# Altium project GECKO3.PRJPCB (part 4 of 4)

## Sheet dram2.SCHDOC: Second DDR SDRAM
size A3; Organization: Berne University of Applied Science; Address1: School of Engineering and; Address2: Information Technology; Address3: Quellgasse 21; Address4: CH-2501 Biel; Revision: 1.0; SheetNumber: 10; SheetTotal: 19; ApprovedBy: zem1; Author: zac1
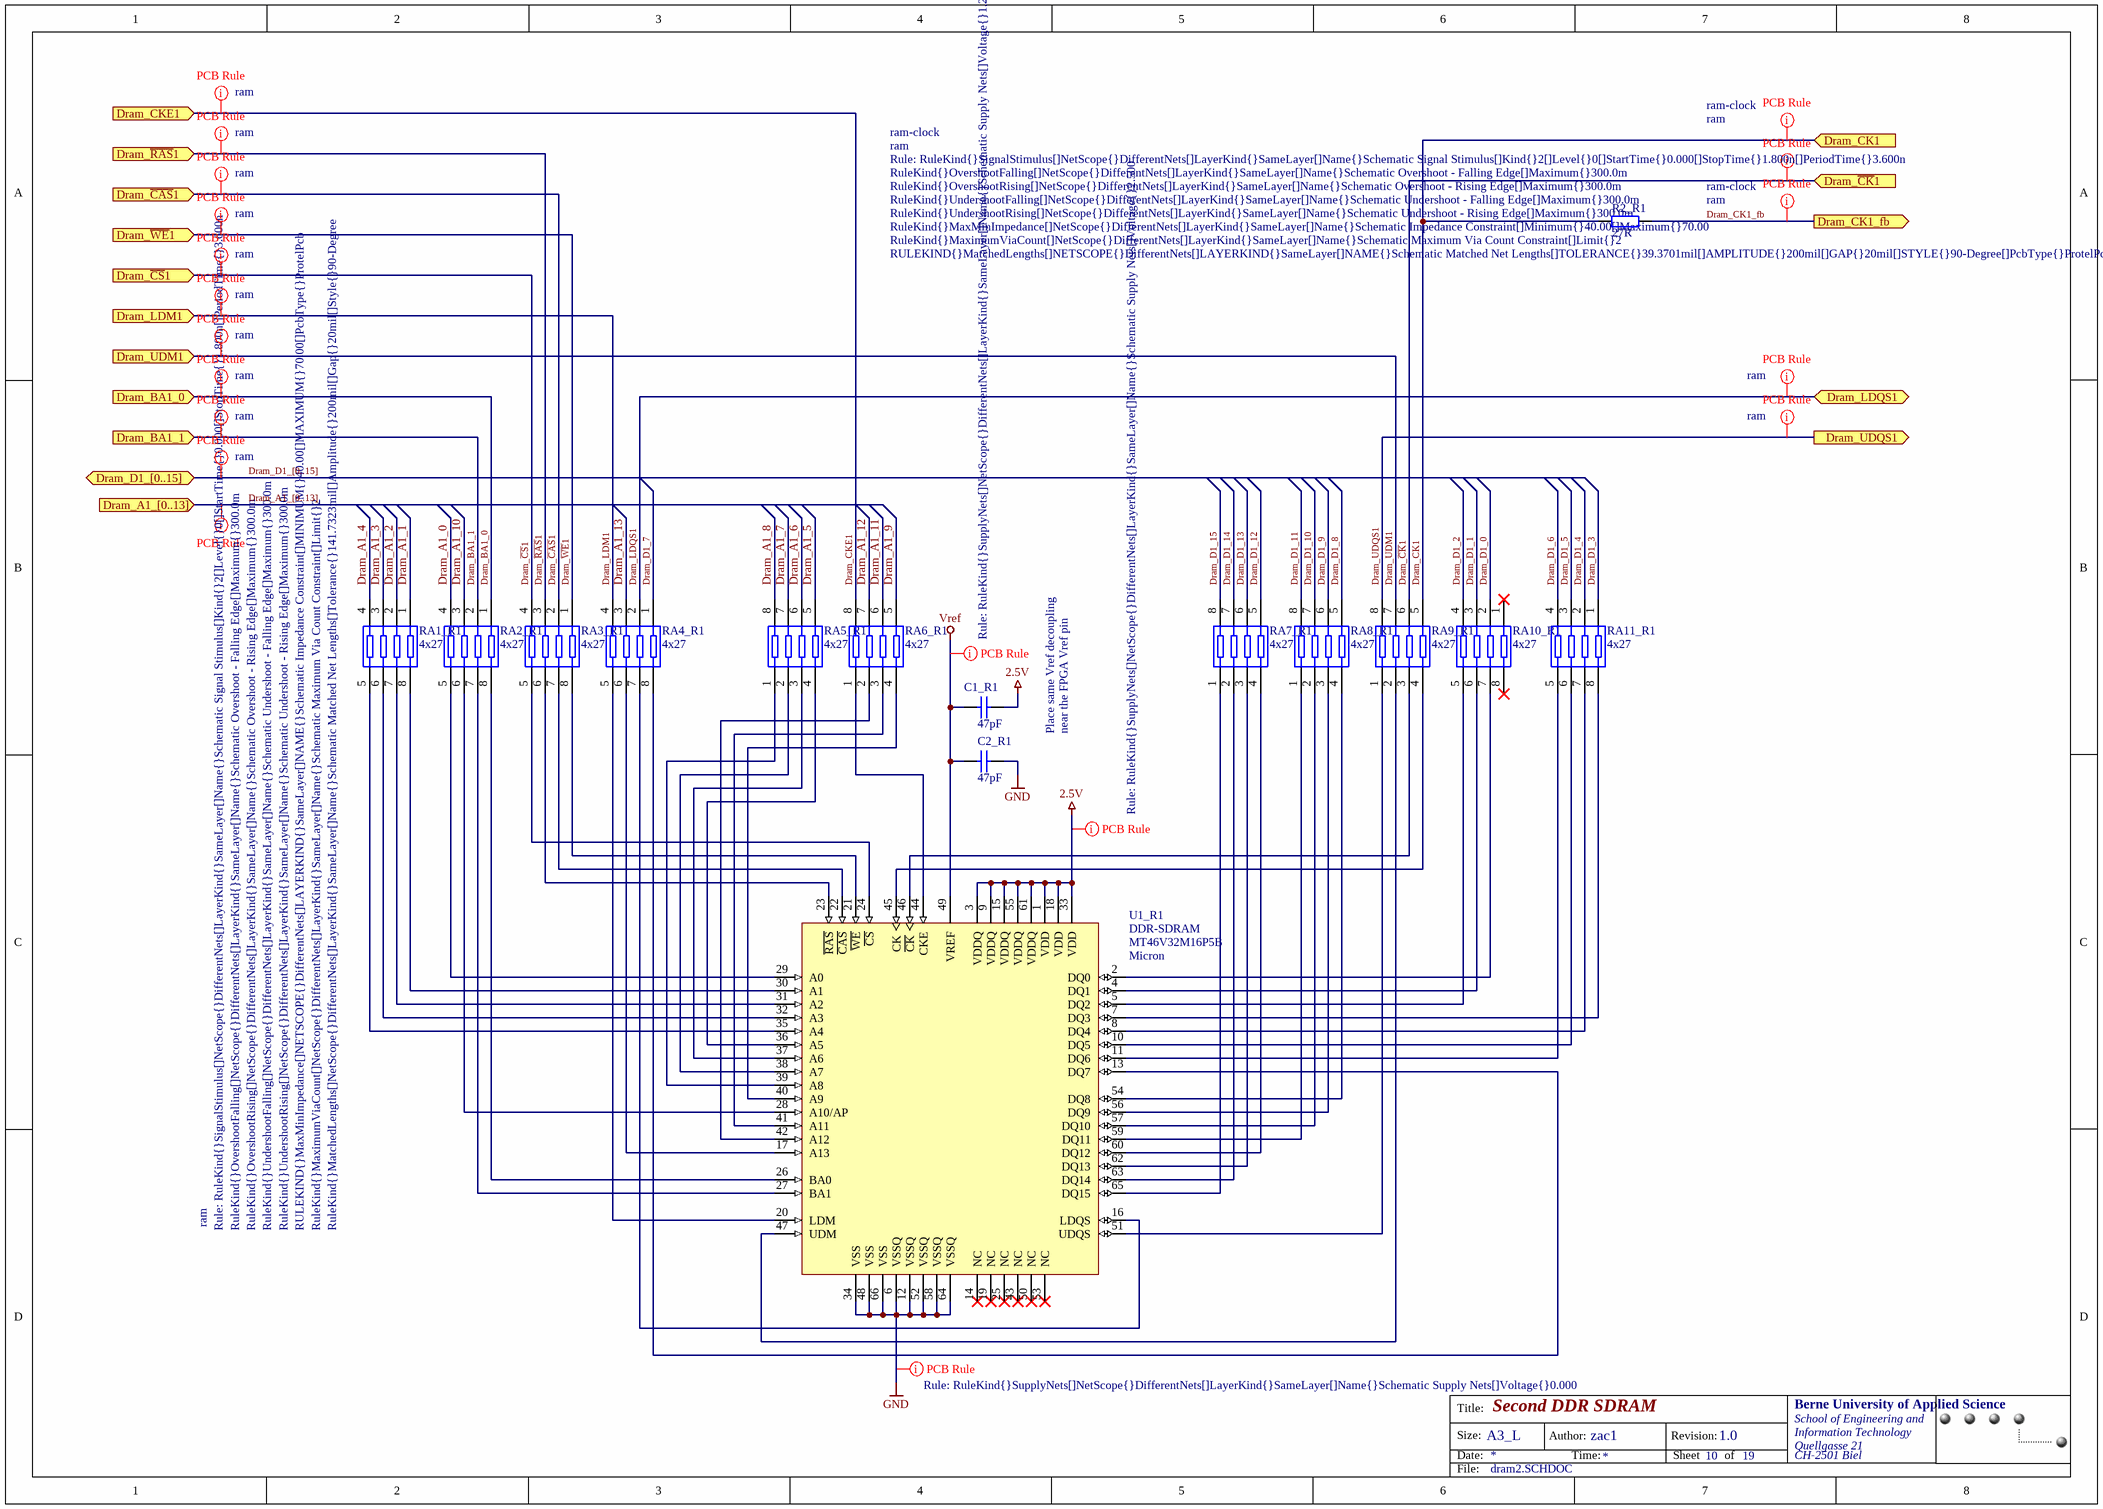
[diagram p16: dram2.SCHDOC]

### Parts
C1_R1  value 47pF  [0402]  (hidden comment: Cap)
C2_R1  value 47pF  [0402]  (hidden comment: Cap)
R2_R1  value 27R  [0402]  (hidden comment: Res2)
RA1_R1  value 4x27  [1206_ARRAY]
RA2_R1  value 4x27  [1206_ARRAY]
RA3_R1  value 4x27  [1206_ARRAY]
RA4_R1  value 4x27  [1206_ARRAY]
RA5_R1  value 4x27  [1206_ARRAY]
RA6_R1  value 4x27  [1206_ARRAY]
RA7_R1  value 4x27  [1206_ARRAY]
RA8_R1  value 4x27  [1206_ARRAY]
RA9_R1  value 4x27  [1206_ARRAY]
RA10_R1  value 4x27  [1206_ARRAY]
RA11_R1  value 4x27  [1206_ARRAY]
U1_R1  DDR-SDRAM  value MT46V32M16P5B  vendor: Micron  [TSOP66]

### Ports
Dram_A1_[0..13] (in), Dram_BA1_0 (in), Dram_BA1_1 (in), Dram_CK1 (in), Dram_CK1_fb (out), Dram_CKE1 (in), Dram_D1_[0..15] (bidir), Dram_LDM1 (in), Dram_LDQS1 (bidir), Dram_UDM1 (in), Dram_UDQS1 (out), Dram_~{CAS}1 (in), Dram_~{CK}1 (in), Dram_~{CS}1 (in), Dram_~{RAS}1 (in), Dram_~{WE}1 (in)

### Nets
2.5V: C1_R1.1 U1_R1.1(VDD) U1_R1.3(VDDQ) U1_R1.9(VDDQ) U1_R1.15(VDDQ) U1_R1.18(VDD) U1_R1.33(VDD) U1_R1.55(VDDQ) U1_R1.61(VDDQ)
GND: C2_R1.1 U1_R1.6(VSSQ) U1_R1.12(VSSQ) U1_R1.34(VSS) U1_R1.48(VSS) U1_R1.52(VSSQ) U1_R1.58(VSSQ) U1_R1.64(VSSQ) U1_R1.66(VSS)
Vref: C1_R1.2 C2_R1.2 U1_R1.49(VREF)
Dram_A1_0: RA2_R1.4
Dram_A1_1: RA1_R1.1
Dram_A1_2: RA1_R1.2
Dram_A1_3: RA1_R1.3
Dram_A1_4: RA1_R1.4
Dram_A1_5: RA5_R1.5
Dram_A1_6: RA5_R1.6
Dram_A1_7: RA5_R1.7
Dram_A1_8: RA5_R1.8
Dram_A1_9: RA6_R1.5
Dram_A1_10: RA2_R1.3
Dram_A1_11: RA6_R1.6
Dram_A1_12: RA6_R1.7
Dram_A1_13: RA4_R1.3
Dram_BA1_0: RA2_R1.1 ; port Dram_BA1_0
Dram_BA1_1: RA2_R1.2 ; port Dram_BA1_1
Dram_~{CAS}1: RA3_R1.2 ; port Dram_~{CAS}1
Dram_~{CK}1: RA9_R1.6 ; port Dram_~{CK}1
Dram_~{CS}1: RA3_R1.4 ; port Dram_~{CS}1
Dram_CK1: R2_R1.2 RA9_R1.5 ; port Dram_CK1
DRAM_CK1_FB: R2_R1.1 ; port Dram_CK1_fb
Dram_CKE1: RA6_R1.8 ; port Dram_CKE1
Dram_D1_0: RA10_R1.2
Dram_D1_1: RA10_R1.3
Dram_D1_2: RA10_R1.4
Dram_D1_3: RA11_R1.1
Dram_D1_4: RA11_R1.2
Dram_D1_5: RA11_R1.3
Dram_D1_6: RA11_R1.4
Dram_D1_7: RA4_R1.1
Dram_D1_8: RA8_R1.5
Dram_D1_9: RA8_R1.6
Dram_D1_10: RA8_R1.7
Dram_D1_11: RA8_R1.8
Dram_D1_12: RA7_R1.5
Dram_D1_13: RA7_R1.6
Dram_D1_14: RA7_R1.7
Dram_D1_15: RA7_R1.8
Dram_LDM1: RA4_R1.4 ; port Dram_LDM1
Dram_LDQS1: RA4_R1.2 ; port Dram_LDQS1
Dram_~{RAS}1: RA3_R1.3 ; port Dram_~{RAS}1
Dram_UDM1: RA9_R1.7 ; port Dram_UDM1
Dram_UDQS1: RA9_R1.8 ; port Dram_UDQS1
Dram_~{WE}1: RA3_R1.1 ; port Dram_~{WE}1
NetRA1_R1_5: RA1_R1.5 U1_R1.35(A4)
NetRA1_R1_6: RA1_R1.6 U1_R1.32(A3)
NetRA1_R1_7: RA1_R1.7 U1_R1.31(A2)
NetRA1_R1_8: RA1_R1.8 U1_R1.30(A1)
NetRA2_R1_5: RA2_R1.5 U1_R1.29(A0)
NetRA2_R1_6: RA2_R1.6 U1_R1.28(A10/AP)
NetRA2_R1_7: RA2_R1.7 U1_R1.27(BA1)
NetRA2_R1_8: RA2_R1.8 U1_R1.26(BA0)
NetRA3_R1_5: RA3_R1.5 U1_R1.24(~{CS})
NetRA3_R1_6: RA3_R1.6 U1_R1.23(~{RAS})
NetRA3_R1_7: RA3_R1.7 U1_R1.22(~{CAS})
NetRA3_R1_8: RA3_R1.8 U1_R1.21(~{WE})
NetRA4_R1_5: RA4_R1.5 U1_R1.20(LDM)
NetRA4_R1_6: RA4_R1.6 U1_R1.17(A13)
NetRA4_R1_7: RA4_R1.7 U1_R1.16(LDQS)
NetRA4_R1_8: RA4_R1.8 U1_R1.13(DQ7)
NetRA5_R1_1: RA5_R1.1 U1_R1.39(A8)
NetRA5_R1_2: RA5_R1.2 U1_R1.38(A7)
NetRA5_R1_3: RA5_R1.3 U1_R1.37(A6)
NetRA5_R1_4: RA5_R1.4 U1_R1.36(A5)
NetRA6_R1_1: RA6_R1.1 U1_R1.44(CKE)
NetRA6_R1_2: RA6_R1.2 U1_R1.42(A12)
NetRA6_R1_3: RA6_R1.3 U1_R1.41(A11)
NetRA6_R1_4: RA6_R1.4 U1_R1.40(A9)
NetRA7_R1_1: RA7_R1.1 U1_R1.65(DQ15)
NetRA7_R1_2: RA7_R1.2 U1_R1.63(DQ14)
NetRA7_R1_3: RA7_R1.3 U1_R1.62(DQ13)
NetRA7_R1_4: RA7_R1.4 U1_R1.60(DQ12)
NetRA8_R1_1: RA8_R1.1 U1_R1.59(DQ11)
NetRA8_R1_2: RA8_R1.2 U1_R1.57(DQ10)
NetRA8_R1_3: RA8_R1.3 U1_R1.56(DQ9)
NetRA8_R1_4: RA8_R1.4 U1_R1.54(DQ8)
NetRA9_R1_1: RA9_R1.1 U1_R1.51(UDQS)
NetRA9_R1_2: RA9_R1.2 U1_R1.47(UDM)
NetRA9_R1_3: RA9_R1.3 U1_R1.46(~{CK})
NetRA9_R1_4: RA9_R1.4 U1_R1.45(CK)
NetRA10_R1_5: RA10_R1.5 U1_R1.5(DQ2)
NetRA10_R1_6: RA10_R1.6 U1_R1.4(DQ1)
NetRA10_R1_7: RA10_R1.7 U1_R1.2(DQ0)
NetRA11_R1_5: RA11_R1.5 U1_R1.11(DQ6)
NetRA11_R1_6: RA11_R1.6 U1_R1.10(DQ5)
NetRA11_R1_7: RA11_R1.7 U1_R1.8(DQ4)
NetRA11_R1_8: RA11_R1.8 U1_R1.7(DQ3)

Not connected (* = marked no-connect by the designer): RA10_R1 1* 8*; U1_R1 14(NC)* 19(NC)* 25(NC)* 43(NC)* 50(NC)* 53(NC)*

### Buses and harness runs
bus Dram_A1_[0..13] = port Dram_A1_[0..13]
bus Dram_D1_[0..15] = port Dram_D1_[0..15]

### Layout directives
rule Supply Nets [Voltage =  2.500]: 2.5V
rule Supply Nets [Voltage =  1.250]: Vref
rule Supply Nets [Voltage =  0.000]: GND
rule Signal Stimulus [Kind - Periodic Pulse    Level - Low    Start Time =  0.000    Stop Time =  1.800n    Period Time =  3.600n]; rule Overshoot - Falling Edge [Max =  300.0m]; rule Overshoot - Rising Edge [Max =  300.0m]; rule Undershoot - Falling Edge [Max =  300.0m]; rule Undershoot - Rising Edge [Max =  300.0m]; rule Impedance Constraint [Min = 40.00    Max = 70.00    ]; rule Maximum Via Count Constraint [Max Count = 2]; rule Matched Net Lengths [Tolerance = 3.6mm    Style - 90 Degrees    Amplitude = 5.08mm    Gap = 0.508mm    ]; net class ram: (no net found under the mark)
net class ram: (no net found under the mark), Dram_BA1_0, Dram_BA1_1, Dram_CKE1, Dram_LDM1, Dram_LDQS1, Dram_UDM1, Dram_UDQS1, Dram_~{CAS}1, Dram_~{CS}1, Dram_~{RAS}1, Dram_~{WE}1
net class ram-clock; net class ram: Dram_CK1, DRAM_CK1_FB
rule Signal Stimulus [Kind - Periodic Pulse    Level - Low    Start Time =  0.000    Stop Time =  1.800n    Period Time =  3.600n]; rule Overshoot - Falling Edge [Max =  300.0m]; rule Overshoot - Rising Edge [Max =  300.0m]; rule Undershoot - Falling Edge [Max =  300.0m]; rule Undershoot - Rising Edge [Max =  300.0m]; rule Impedance Constraint [Min =  40.00    Max =  70.00    ]; rule Maximum Via Count Constraint [Max Count = 2]; rule Matched Net Lengths [Tolerance = 1mm    Style - 90 Degrees    Amplitude = 5.08mm    Gap = 0.508mm    ]; net class ram-clock; net class ram: Dram_~{CK}1

### Notes on the sheet
- Place same Vref decoupling
- near the FPGA Vref pin
- Title:
- Size:
- Date:
- A3_L
- Author:
- Time:
- Revision:
- Sheet
- of
- File:

### Library data of the parts
C1_R1 C2_R1 = Cap: Capacitor; Manufacturer: Murata; Part Number: GRM1555C1H470JZ01D; Class I: Passive; Currency: CHF; Packaging unit: 10; Prize: 0.07; Published: 8-Jun-2000; Revision: July-2002: Re-released for DXP Platform.; Publisher: Altium Limited; Class II: Capacitor; Distributor Number: 8819 670; RoHS: yes; Distributor: Farnell
R2_R1 = Res2: Resistor; Manufacturer: PHYCOMP; Part Number: 232270672709; Class I: Passive; Currency: CHF; Packaging unit: 50; Prize: 0.12; Published: 8-Jun-2000; Revision: July-2002: Re-released for DXP Platform.; Publisher: Altium Limited; Class II: Resistor; Distributor Number: 9239049; RoHS: yes; Distributor: Farnell
RA1_R1 RA2_R1 RA3_R1 RA4_R1 RA5_R1 RA6_R1 RA7_R1 RA8_R1 RA9_R1 RA10_R1 RA11_R1 = R_ARRAY_4_SMD: Manufacturer: PHYCOMP; Part Number: 235003410279; Currency: CHF; Packaging unit: 10; Prize: 0.17; Distributor Number: 9234969; RoHS: yes; Distributor: Farnell
U1_R1 = DDR-SDRAM: general model for ddr sdram's; Currency: CHF; lead time: 12 Weeks; Packaging unit: 108; Prize: 15.87; Distributor Number: MT46V32M16P5B; Manufacturer: Micron; Part Number: MT46V32M16P5B; RoHS: yes; Distributor: Silica

## Nets that join several sheets
1.2V: power (C6_PWR.1 C7_PWR.1 L1_PWR.2 R5_PWR.1), fpga-config (42 pins)
2.5V: power (14 pins), fpga-config (69 pins), fpga1 (C1_FP1.2), fpga2 (C1_FP2.2), dram1 (9 pins), dram2 (9 pins)
3.3V: power (C10_PWR.2 U2_PWR.3), fpga-config (92 pins), fpga1 (Q1_FP1.4 R1_FP1.1), spi-flash (U1_SPI.3 U1_SPI.7 U1_SPI.8), ethernet (17 pins), jtag (JP1_JTAG.6 JP2_JTAG.4), i2c (R3_I2C.2 U1_I2C.8 U2_I2C.1 U2_I2C.8), io-bus (C2_IO.1 FB2_IO.1 R1_IO.2 R2_IO.2), switches (8 pins), usb (21 pins), flash (18 pins)
GND: power (28 pins), fpga-config (176 pins), fpga1 (C2_FP1.1 Q1_FP1.2), fpga2 (C2_FP2.1), spi-flash (U1_SPI.4), ethernet (21 pins), jtag (JP1_JTAG.5 JP2_JTAG.1), i2c (8 pins), io-bus (53 pins), io-bus2 (8 pins), switches (16 pins), usb (27 pins), flash (18 pins), dram1 (9 pins), dram2 (9 pins)
Ubatt: power (5 pins), io-bus (FB1_IO.1)
Vref: power (C15_PWR.2 R6_PWR.1 R7_PWR.2), fpga1 (8 pins), fpga2 (8 pins), dram1 (C1_R0.2 C2_R0.2 U1_R0.49), dram2 (C1_R1.2 C2_R1.2 U1_R1.49)
BUSY/RDYX: fpga1 (U1.AD14), usb (U1_USB.2)
BUTTON0: fpga1 (U1.E7), switches (R9_SW.2 S1_SW.1)
BUTTON1: fpga1 (U1.G10), switches (R10_SW.2 S2_SW.1)
BUTTON2: fpga1 (U1.E12), switches (R11_SW.2 S3_SW.1)
CCLK: fpga-config (R3_CNF.1), usb (U1_USB.29)
COL: fpga2 (U1.AF5), ethernet (R16_ETH.2 U1_ETH.42)
CRS: fpga2 (U1.AF7), ethernet (U1_ETH.40)
CS_B/RDYU: fpga2 (U1.AB5), usb (U1_USB.31)
D0: fpga2 (U1.AA12), usb (U1_USB.18)
D1: fpga2 (U1.AB12), usb (U1_USB.19)
D2: fpga2 (U1.AB13), usb (U1_USB.20)
D3: fpga2 (U1.AC13), usb (U1_USB.21)
D4: fpga1 (U1.AA14), usb (U1_USB.22)
D5: fpga1 (U1.Y14), usb (U1_USB.23)
D6: fpga1 (U1.W14), usb (U1_USB.24)
D7: fpga1 (U1.Y15), usb (U1_USB.25)
D8: fpga2 (U1.Y9), usb (U1_USB.45)
D9: fpga2 (U1.Y10), usb (U1_USB.46)
D10: fpga2 (U1.Y11), usb (U1_USB.47)
D11: fpga2 (U1.W11), usb (U1_USB.48)
D12: fpga2 (U1.Y12), usb (U1_USB.49)
D13: fpga2 (U1.W12), usb (U1_USB.50)
D14: fpga2 (U1.Y13), usb (U1_USB.51)
D15: fpga2 (U1.W13), usb (U1_USB.52)
DONE: fpga-config (R2_CNF.2 U1.AC24), usb (U1_USB.40)
DRAM_A0_0: fpga1 (U1.P6), dram1 (RA2_R0.4)
DRAM_A0_1: fpga1 (U1.R7), dram1 (RA1_R0.1)
DRAM_A0_2: fpga1 (U1.P7), dram1 (RA1_R0.2)
DRAM_A0_3: fpga1 (U1.R8), dram1 (RA1_R0.3)
DRAM_A0_4: fpga1 (U1.T8), dram1 (RA1_R0.4)
Dram_A0_5: fpga1 (U1.AB4), dram1 (RA5_R0.5)
Dram_A0_6: fpga1 (U1.AB3), dram1 (RA5_R0.6)
DRAM_A0_7: fpga1 (U1.AC1), dram1 (RA5_R0.7)
Dram_A0_8: fpga1 (U1.AD2), dram1 (RA5_R0.8)
Dram_A0_9: fpga1 (U1.AD1), dram1 (RA6_R0.5)
DRAM_A0_10: fpga1 (U1.T6), dram1 (RA2_R0.3)
DRAM_A0_11: fpga1 (U1.W7), dram1 (RA6_R0.6)
DRAM_A0_12: fpga1 (U1.W6), dram1 (RA6_R0.7)
DRAM_A0_13: fpga1 (U1.V3), dram1 (RA4_R0.3)
Dram_A1_0: fpga2 (U1.L2), dram2 (RA2_R1.4)
Dram_A1_1: fpga2 (U1.M3), dram2 (RA1_R1.1)
Dram_A1_2: fpga2 (U1.K1), dram2 (RA1_R1.2)
Dram_A1_3: fpga2 (U1.M2), dram2 (RA1_R1.3)
Dram_A1_4: fpga2 (U1.L1), dram2 (RA1_R1.4)
Dram_A1_5: fpga2 (U1.M1), dram2 (RA5_R1.5)
Dram_A1_6: fpga2 (U1.N8), dram2 (RA5_R1.6)
Dram_A1_7: fpga2 (U1.N6), dram2 (RA5_R1.7)
Dram_A1_8: fpga2 (U1.N7), dram2 (RA5_R1.8)
Dram_A1_9: fpga2 (U1.M5), dram2 (RA6_R1.5)
Dram_A1_10: fpga2 (U1.N5), dram2 (RA2_R1.3)
Dram_A1_11: fpga2 (U1.N2), dram2 (RA6_R1.6)
Dram_A1_12: fpga2 (U1.N3), dram2 (RA6_R1.7)
Dram_A1_13: fpga2 (U1.K5), dram2 (RA4_R1.3)
DRAM_BA0_0: fpga1 (U1.V5), dram1 (RA2_R0.1)
DRAM_BA0_1: fpga1 (U1.U6), dram1 (RA2_R0.2)
Dram_BA1_0: fpga2 (U1.K3), dram2 (RA2_R1.1)
Dram_BA1_1: fpga2 (U1.J2), dram2 (RA2_R1.2)
DRAM_~{CAS}0: fpga1 (U1.U7), dram1 (RA3_R0.2)
Dram_~{CAS}1: fpga2 (U1.K4), dram2 (RA3_R1.2)
DRAM_~{CK}0: fpga1 (U1.W2), dram1 (RA9_R0.6)
Dram_~{CK}1: fpga2 (U1.F6), dram2 (RA9_R1.6)
DRAM_~{CS}0: fpga1 (U1.V7), dram1 (RA3_R0.4)
Dram_~{CS}1: fpga2 (U1.M8), dram2 (RA3_R1.4)
DRAM_CK0: fpga1 (U1.W1), dram1 (R2_R0.2 RA9_R0.5)
Dram_CK0_fb: fpga1 (U1.AE14), dram1 (R2_R0.1)
Dram_CK1: fpga2 (U1.F5), dram2 (R2_R1.2 RA9_R1.5)
DRAM_CK1_FB: fpga2 (U1.C14), dram2 (R2_R1.1)
DRAM_CKE0: fpga1 (U1.W5), dram1 (RA6_R0.8)
Dram_CKE1: fpga2 (U1.N4), dram2 (RA6_R1.8)
DRAM_D0_0: fpga1 (U1.P3), dram1 (RA10_R0.2)
DRAM_D0_1: fpga1 (U1.P8), dram1 (RA10_R0.3)
DRAM_D0_2: fpga1 (U1.T2), dram1 (RA10_R0.4)
DRAM_D0_3: fpga1 (U1.R3), dram1 (RA11_R0.1)
DRAM_D0_4: fpga1 (U1.P2), dram1 (RA11_R0.2)
DRAM_D0_5: fpga1 (U1.T1), dram1 (RA11_R0.3)
DRAM_D0_6: fpga1 (U1.U2), dram1 (RA11_R0.4)
DRAM_D0_7: fpga1 (U1.U1), dram1 (RA4_R0.1)
DRAM_D0_8: fpga1 (U1.U5), dram1 (RA8_R0.5)
DRAM_D0_9: fpga1 (U1.U3), dram1 (RA8_R0.6)
DRAM_D0_10: fpga1 (U1.T5), dram1 (RA8_R0.7)
DRAM_D0_11: fpga1 (U1.T4), dram1 (RA8_R0.8)
DRAM_D0_12: fpga1 (U1.R5), dram1 (RA7_R0.5)
DRAM_D0_13: fpga1 (U1.R6), dram1 (RA7_R0.6)
DRAM_D0_14: fpga1 (U1.P4), dram1 (RA7_R0.7)
DRAM_D0_15: fpga1 (U1.P5), dram1 (RA7_R0.8)
Dram_D1_0: fpga2 (U1.L6), dram2 (RA10_R1.2)
Dram_D1_1: fpga2 (U1.K7), dram2 (RA10_R1.3)
Dram_D1_2: fpga2 (U1.J7), dram2 (RA10_R1.4)
Dram_D1_3: fpga2 (U1.K6), dram2 (RA11_R1.1)
Dram_D1_4: fpga2 (U1.J6), dram2 (RA11_R1.2)
Dram_D1_5: fpga2 (U1.J5), dram2 (RA11_R1.3)
Dram_D1_6: fpga2 (U1.M7), dram2 (RA11_R1.4)
Dram_D1_7: fpga2 (U1.M6), dram2 (RA4_R1.1)
Dram_D1_8: fpga2 (U1.J3), dram2 (RA8_R1.5)
Dram_D1_9: fpga2 (U1.G1), dram2 (RA8_R1.6)
Dram_D1_10: fpga2 (U1.G2), dram2 (RA8_R1.7)
Dram_D1_11: fpga2 (U1.H3), dram2 (RA8_R1.8)
Dram_D1_12: fpga2 (U1.H4), dram2 (RA7_R1.5)
Dram_D1_13: fpga2 (U1.D2), dram2 (RA7_R1.6)
Dram_D1_14: fpga2 (U1.E3), dram2 (RA7_R1.7)
Dram_D1_15: fpga2 (U1.E4), dram2 (RA7_R1.8)
DRAM_LDM0: fpga1 (U1.V2), dram1 (RA4_R0.4)
Dram_LDM1: fpga2 (U1.L5), dram2 (RA4_R1.4)
DRAM_LDQS0: fpga1 (U1.R1), dram1 (RA4_R0.2)
Dram_LDQS1: fpga2 (U1.L7), dram2 (RA4_R1.2)
DRAM_~{RAS}0: fpga1 (U1.V6), dram1 (RA3_R0.3)
Dram_~{RAS}1: fpga2 (U1.J4), dram2 (RA3_R1.3)
DRAM_UDM0: fpga1 (U1.V4), dram1 (RA9_R0.7)
Dram_UDM1: fpga2 (U1.K2), dram2 (RA9_R1.7)
DRAM_UDQS0: fpga1 (U1.W4), dram1 (RA9_R0.8)
Dram_UDQS1: fpga2 (U1.H2), dram2 (RA9_R1.8)
DRAM_~{WE}0: fpga1 (U1.T7), dram1 (RA3_R0.1)
Dram_~{WE}1: fpga2 (U1.L4), dram2 (RA3_R1.1)
ENCODER0: fpga2 (U1.AA22), io-bus (JP1_IO.62 JP2_IO.62)
ENCODER1: fpga2 (U1.AB23), io-bus (JP1_IO.64 JP2_IO.64)
ENCODER2: fpga1 (U1.AB22), io-bus (JP1_IO.66 JP2_IO.66)
ENCODER3: fpga2 (U1.AC25), io-bus (JP1_IO.68 JP2_IO.68)
ENCODER4: fpga2 (U1.W23), io-bus (JP1_IO.70 JP2_IO.70)
ENCODER5: fpga2 (U1.V22), io-bus (JP1_IO.72 JP2_IO.72)
ENCODER6: fpga2 (U1.U22), io-bus (JP1_IO.74 JP2_IO.74)
ENCODER7: fpga2 (U1.R20), io-bus (JP1_IO.76 JP2_IO.76)
ETH_~{RESET}: fpga2 (U1.AF13), ethernet (R3_ETH.2 U1_ETH.29)
EXTCLK0: fpga2 (U1.AE13), io-bus (JP1_IO.7 JP2_IO.7)
EXTCLK1: fpga2 (U1.AD13), io-bus (JP1_IO.10 JP2_IO.10)
FLASH_A0: fpga2 (U1.G17), flash (U1_FL.32 U2_FL.32)
FLASH_A1: fpga2 (U1.H15), flash (U1_FL.28 U2_FL.28)
FLASH_A2: fpga2 (U1.G15), flash (U1_FL.27 U2_FL.27)
FLASH_A3: fpga2 (U1.H14), flash (U1_FL.26 U2_FL.26)
FLASH_A4: fpga2 (U1.G14), flash (U1_FL.25 U2_FL.25)
FLASH_A5: fpga1 (U1.G13), flash (U1_FL.24 U2_FL.24)
FLASH_A6: fpga1 (U1.H13), flash (U1_FL.23 U2_FL.23)
FLASH_A7: fpga1 (U1.G12), flash (U1_FL.22 U2_FL.22)
FLASH_A8: fpga2 (U1.D17), flash (U1_FL.20 U2_FL.20)
FLASH_A9: fpga1 (U1.G11), flash (U1_FL.19 U2_FL.19)
FLASH_A10: fpga2 (U1.F16), flash (U1_FL.18 U2_FL.18)
FLASH_A11: fpga1 (U1.F12), flash (U1_FL.17 U2_FL.17)
FLASH_A12: fpga1 (U1.F11), flash (U1_FL.13 U2_FL.13)
FLASH_A13: fpga2 (U1.F14), flash (U1_FL.12 U2_FL.12)
FLASH_A14: fpga1 (U1.E11), flash (U1_FL.11 U2_FL.11)
FLASH_A15: fpga2 (U1.E14), flash (U1_FL.10 U2_FL.10)
FLASH_A16: fpga1 (U1.D11), flash (U1_FL.8 U2_FL.8)
FLASH_A17: fpga1 (U1.H12), flash (U1_FL.7 U2_FL.7)
FLASH_A18: fpga1 (U1.H11), flash (U1_FL.6 U2_FL.6)
FLASH_A19: fpga1 (U1.D10), flash (U1_FL.5 U2_FL.5)
FLASH_A20: fpga1 (U1.C10), flash (U1_FL.4 U2_FL.4)
FLASH_A21: fpga1 (U1.A12), flash (U1_FL.3 U2_FL.3)
FLASH_A22: fpga1 (U1.B12), flash (U1_FL.1 U2_FL.1)
FLASH_A23: fpga2 (U1.G16), flash (U1_FL.30 U2_FL.30)
FLASH_~{BYTE}: fpga2 (U1.H16), flash (U1_FL.31 U2_FL.31)
FLASH_~{CE0}: fpga2 (U1.E15), flash (R1_FL.2 U1_FL.14 U2_FL.14)
FLASH_D0_0: fpga2 (U1.F18), flash (U1_FL.33)
FLASH_D0_1: fpga2 (U1.G19), flash (U1_FL.35)
FLASH_D0_2: fpga2 (U1.A20), flash (U1_FL.38)
FLASH_D0_3: fpga2 (U1.E20), flash (U1_FL.40)
FLASH_D0_4: fpga2 (U1.E21), flash (U1_FL.44)
FLASH_D0_5: fpga1 (U1.H23), flash (U1_FL.46)
FLASH_D0_6: fpga1 (U1.H24), flash (U1_FL.49)
FLASH_D0_7: fpga2 (U1.B20), flash (U1_FL.51)
FLASH_D0_8: fpga2 (U1.G18), flash (U1_FL.34)
FLASH_D0_9: fpga2 (U1.F20), flash (U1_FL.36)
FLASH_D0_10: fpga2 (U1.D20), flash (U1_FL.39)
FLASH_D0_11: fpga2 (U1.A21), flash (U1_FL.41)
FLASH_D0_12: fpga2 (U1.F21), flash (U1_FL.45)
FLASH_D0_13: fpga1 (U1.E23), flash (U1_FL.47)
FLASH_D0_14: fpga1 (U1.E24), flash (U1_FL.50)
FLASH_D0_15: fpga1 (U1.D25), flash (U1_FL.52)
FLASH_D1_0: fpga1 (U1.E6), flash (U2_FL.33)
FLASH_D1_1: fpga1 (U1.D5), flash (U2_FL.35)
FLASH_D1_2: fpga1 (U1.C4), flash (U2_FL.38)
FLASH_D1_3: fpga1 (U1.B8), flash (U2_FL.40)
FLASH_D1_4: fpga1 (U1.B7), flash (U2_FL.44)
FLASH_D1_5: fpga1 (U1.B6), flash (U2_FL.46)
FLASH_D1_6: fpga1 (U1.B5), flash (U2_FL.49)
FLASH_D1_7: fpga1 (U1.B4), flash (U2_FL.51)
FLASH_D1_8: fpga1 (U1.C5), flash (U2_FL.34)
FLASH_D1_9: fpga1 (U1.E5), flash (U2_FL.36)
FLASH_D1_10: fpga1 (U1.A8), flash (U2_FL.39)
FLASH_D1_11: fpga1 (U1.A7), flash (U2_FL.41)
FLASH_D1_12: fpga1 (U1.A6), flash (U2_FL.45)
FLASH_D1_13: fpga1 (U1.A5), flash (U2_FL.47)
FLASH_D1_14: fpga1 (U1.A4), flash (U2_FL.50)
FLASH_D1_15: fpga1 (U1.A3), flash (U2_FL.52)
FLASH_~{OE}: fpga2 (U1.B21), flash (U1_FL.54 U2_FL.54)
FLASH_~{RP}: fpga2 (U1.F15), flash (R2_FL.1 U1_FL.16 U2_FL.16)
FLASH_~{WE}: fpga1 (U1.B3), flash (U1_FL.55 U2_FL.55)
GPIO1_0: fpga1 (U1.AF19), io-bus (JP1_IO.4 JP2_IO.4)
GPIO1_1: fpga1 (U1.AE20), io-bus (JP1_IO.6 JP2_IO.6)
GPIO1_2: fpga1 (U1.AD19), io-bus (JP1_IO.11 JP2_IO.11)
GPIO1_3: fpga1 (U1.AD25), io-bus (JP1_IO.14 JP2_IO.14)
GPIO1_4: fpga1 (U1.AE18), io-bus (JP1_IO.13 JP2_IO.13)
GPIO1_5: fpga1 (U1.AC21), io-bus (JP1_IO.16 JP2_IO.16)
GPIO1_6: fpga1 (U1.AE23), io-bus (JP1_IO.15 JP2_IO.15)
GPIO1_7: fpga1 (U1.AC22), io-bus (JP1_IO.18 JP2_IO.18)
GPIO1_8: fpga1 (U1.AF22), io-bus (JP1_IO.17 JP2_IO.17)
GPIO1_9: fpga1 (U1.AB20), io-bus (JP1_IO.20 JP2_IO.20)
GPIO1_10: fpga1 (U1.AE22), io-bus (JP1_IO.19 JP2_IO.19)
GPIO1_11: fpga1 (U1.AB19), io-bus (JP1_IO.22 JP2_IO.22)
GPIO1_12: fpga2 (U1.AB25), io-bus (JP1_IO.21 JP2_IO.21)
GPIO1_13: fpga2 (U1.AA24), io-bus (JP1_IO.24 JP2_IO.24)
GPIO1_14: fpga2 (U1.AA25), io-bus (JP1_IO.23 JP2_IO.23)
GPIO1_15: fpga1 (U1.AC20), io-bus (JP1_IO.26 JP2_IO.26)
GPIO1_16: fpga1 (U1.AC19), io-bus (JP1_IO.25 JP2_IO.25)
GPIO1_17: fpga1 (U1.AB18), io-bus (JP1_IO.28 JP2_IO.28)
GPIO1_18: fpga1 (U1.AB17), io-bus (JP1_IO.27 JP2_IO.27)
GPIO1_19: fpga2 (U1.U20), io-bus (JP1_IO.84 JP2_IO.84)
GPIO1_20: fpga2 (U1.T20), io-bus (JP1_IO.85 JP2_IO.85)
GPIO1_21: fpga2 (U1.R22), io-bus (JP1_IO.86 JP2_IO.86)
GPIO1_22: fpga2 (U1.R21), io-bus (JP1_IO.87 JP2_IO.87)
GPIO1_23: fpga2 (U1.P22), io-bus (JP1_IO.88 JP2_IO.88)
GPIO1_24: fpga2 (U1.P21), io-bus (JP1_IO.91 JP2_IO.91)
GPIO1_25: fpga1 (U1.N22), io-bus (JP1_IO.92 JP2_IO.92)
GPIO1_26: fpga1 (U1.N21), io-bus (JP1_IO.93 JP2_IO.93)
GPIO1_27: fpga1 (U1.K22), io-bus (JP1_IO.94 JP2_IO.94)
GPIO1_28: fpga1 (U1.L23), io-bus (JP1_IO.95 JP2_IO.95)
GPIO1_29: fpga2 (U1.T19), io-bus (JP1_IO.96 JP2_IO.96)
GPIO1_30: fpga2 (U1.R19), io-bus (JP1_IO.97 JP2_IO.97)
GPIO1_31: fpga2 (U1.P20), io-bus (JP1_IO.98 JP2_IO.98)
GPIO1_32: fpga2 (U1.P19), io-bus (JP1_IO.99 JP2_IO.99)
GPIO1_33: fpga1 (U1.N20), io-bus (JP1_IO.100 JP2_IO.100)
GPIO1_34: fpga1 (U1.N19), io-bus (JP1_IO.101 JP2_IO.101)
GPIO1_35: fpga1 (U1.M20), io-bus (JP1_IO.102 JP2_IO.102)
GPIO1_36: fpga1 (U1.M19), io-bus (JP1_IO.103 JP2_IO.103)
GPIO1_37: fpga1 (U1.L20), io-bus (JP1_IO.104 JP2_IO.104)
GPIO1_38: fpga1 (U1.L19), io-bus (JP1_IO.105 JP2_IO.105)
GPIO1_39: fpga1 (U1.L25), io-bus (JP1_IO.106 JP2_IO.106)
GPIO1_40: fpga1 (U1.K23), io-bus (JP1_IO.107 JP2_IO.107)
GPIO1_41: fpga1 (U1.K25), io-bus (JP1_IO.108 JP2_IO.108)
GPIO1_42: fpga1 (U1.K24), io-bus (JP1_IO.109 JP2_IO.109)
GPIO1_43: fpga1 (U1.J25), io-bus (JP1_IO.110 JP2_IO.110)
GPIO1_44: fpga1 (U1.J23), io-bus (JP1_IO.111 JP2_IO.111)
GPIO1_45: fpga1 (U1.J22), io-bus (JP1_IO.112 JP2_IO.112)
GPIO1_46: fpga1 (U1.H22), io-bus (JP1_IO.113 JP2_IO.113)
GPIO1_47: fpga1 (U1.G23), io-bus (JP1_IO.114 JP2_IO.114)
GPIO1_48: fpga1 (U1.B10), io-bus (JP1_IO.115 JP2_IO.115)
GPIO1_49: fpga1 (U1.B11), io-bus (JP1_IO.116 JP2_IO.116)
GPIO1_50: fpga1 (U1.A10), io-bus (JP1_IO.117 JP2_IO.117)
GPIO1_51: fpga1 (U1.A11), io-bus (JP1_IO.118 JP2_IO.118)
GPIO2_0: fpga1 (U1.AE24), io-bus2 (JP1_IO2.3 JP2_IO2.3)
GPIO2_1: fpga1 (U1.AF23), io-bus2 (JP1_IO2.4 JP2_IO2.4)
GPIO2_2: fpga1 (U1.AF20), io-bus2 (JP1_IO2.5 JP2_IO2.5)
GPIO2_3: fpga1 (U1.AF24), io-bus2 (JP1_IO2.6 JP2_IO2.6)
GPIO2_4: fpga1 (U1.AD21), io-bus2 (JP1_IO2.7 JP2_IO2.7)
GPIO2_5: fpga1 (U1.AF21), io-bus2 (JP1_IO2.8 JP2_IO2.8)
GPIO2_6: fpga1 (U1.AE21), io-bus2 (JP1_IO2.9 JP2_IO2.9)
GPIO2_7: fpga1 (U1.AD22), io-bus2 (JP1_IO2.10 JP2_IO2.10)
GPIO2_8: fpga1 (U1.AB21), io-bus2 (JP1_IO2.11 JP2_IO2.11)
GPIO2_9: fpga1 (U1.AD23), io-bus2 (JP1_IO2.12 JP2_IO2.12)
GPIO2_10: fpga2 (U1.Y23), io-bus2 (JP1_IO2.13 JP2_IO2.13)
GPIO2_11: fpga2 (U1.AB26), io-bus2 (JP1_IO2.14 JP2_IO2.14)
GPIO2_12: fpga2 (U1.Y22), io-bus2 (JP1_IO2.15 JP2_IO2.15)
GPIO2_13: fpga2 (U1.AA26), io-bus2 (JP1_IO2.16 JP2_IO2.16)
GPIO2_14: fpga2 (U1.V23), io-bus2 (JP1_IO2.17 JP2_IO2.17)
GPIO2_15: fpga2 (U1.W26), io-bus2 (JP1_IO2.18 JP2_IO2.18)
GPIO2_16: fpga2 (U1.V24), io-bus2 (JP1_IO2.19 JP2_IO2.19)
GPIO2_17: fpga2 (U1.U26), io-bus2 (JP1_IO2.20 JP2_IO2.20)
GPIO2_18: fpga2 (U1.V25), io-bus2 (JP1_IO2.21 JP2_IO2.21)
GPIO2_19: fpga2 (U1.T26), io-bus2 (JP1_IO2.22 JP2_IO2.22)
GPIO2_20: fpga2 (U1.U23), io-bus2 (JP1_IO2.23 JP2_IO2.23)
GPIO2_21: fpga2 (U1.R26), io-bus2 (JP1_IO2.24 JP2_IO2.24)
GPIO2_22: fpga2 (U1.U24), io-bus2 (JP1_IO2.25 JP2_IO2.25)
GPIO2_23: fpga1 (U1.AB14), io-bus2 (JP1_IO2.26 JP2_IO2.26)
GPIO2_24: fpga2 (U1.U25), io-bus2 (JP1_IO2.27 JP2_IO2.27)
GPIO2_25: fpga2 (U1.AA13), io-bus2 (JP1_IO2.28 JP2_IO2.28)
GPIO2_26: fpga2 (U1.T23), io-bus2 (JP1_IO2.29 JP2_IO2.29)
GPIO2_27: fpga2 (U1.P26), io-bus2 (JP1_IO2.30 JP2_IO2.30)
GPIO2_28: fpga2 (U1.T25), io-bus2 (JP1_IO2.31 JP2_IO2.31)
GPIO2_29: fpga1 (U1.N26), io-bus2 (JP1_IO2.32 JP2_IO2.32)
GPIO2_30: fpga2 (U1.T22), io-bus2 (JP1_IO2.33 JP2_IO2.33)
GPIO2_31: fpga1 (U1.M26), io-bus2 (JP1_IO2.34 JP2_IO2.34)
GPIO2_32: fpga2 (U1.T21), io-bus2 (JP1_IO2.35 JP2_IO2.35)
GPIO2_33: fpga1 (U1.C8), io-bus2 (JP1_IO2.36 JP2_IO2.36)
GPIO2_34: fpga2 (U1.R25), io-bus2 (JP1_IO2.37 JP2_IO2.37)
GPIO2_35: fpga1 (U1.D8), io-bus2 (JP1_IO2.38 JP2_IO2.38)
GPIO2_36: fpga2 (U1.R24), io-bus2 (JP1_IO2.39 JP2_IO2.39)
GPIO2_37: fpga1 (U1.L26), io-bus2 (JP1_IO2.40 JP2_IO2.40)
GPIO2_38: fpga2 (U1.P23), io-bus2 (JP1_IO2.41 JP2_IO2.41)
GPIO2_39: fpga1 (U1.D9), io-bus2 (JP1_IO2.42 JP2_IO2.42)
GPIO2_40: fpga2 (U1.P25), io-bus2 (JP1_IO2.43 JP2_IO2.43)
GPIO2_41: fpga1 (U1.E9), io-bus2 (JP1_IO2.44 JP2_IO2.44)
GPIO2_42: fpga2 (U1.P24), io-bus2 (JP1_IO2.45 JP2_IO2.45)
GPIO2_43: fpga1 (U1.C9), io-bus2 (JP1_IO2.46 JP2_IO2.46)
GPIO2_44: fpga1 (U1.N23), io-bus2 (JP1_IO2.47 JP2_IO2.47)
GPIO2_45: fpga1 (U1.B9), io-bus2 (JP1_IO2.48 JP2_IO2.48)
GPIO2_46: fpga1 (U1.N25), io-bus2 (JP1_IO2.49 JP2_IO2.49)
GPIO2_47: fpga1 (U1.K26), io-bus2 (JP1_IO2.50 JP2_IO2.50)
GPIO2_48: fpga1 (U1.N24), io-bus2 (JP1_IO2.51 JP2_IO2.51)
GPIO2_49: fpga1 (U1.M21), io-bus2 (JP1_IO2.52 JP2_IO2.52)
GPIO2_50: fpga1 (U1.M25), io-bus2 (JP1_IO2.53 JP2_IO2.53)
GPIO2_51: fpga1 (U1.M24), io-bus2 (JP1_IO2.54 JP2_IO2.54)
GPIO2_52: fpga1 (U1.M22), io-bus2 (JP1_IO2.55 JP2_IO2.55)
GPIO2_53: fpga1 (U1.L22), io-bus2 (JP1_IO2.56 JP2_IO2.56)
GPIO2_54: fpga1 (U1.L21), io-bus2 (JP1_IO2.57 JP2_IO2.57)
GPIO2_55: fpga1 (U1.J24), io-bus2 (JP1_IO2.58 JP2_IO2.58)
GPIO2_56: fpga1 (U1.E8), io-bus2 (JP1_IO2.59 JP2_IO2.59)
GPIO2_57: fpga1 (U1.F8), io-bus2 (JP1_IO2.60 JP2_IO2.60)
GPIO2_58: fpga1 (U1.G8), io-bus2 (JP1_IO2.61 JP2_IO2.61)
GPIO2_59: fpga1 (U1.G22), io-bus2 (JP1_IO2.62 JP2_IO2.62)
GPIO2_60: fpga1 (U1.F25), io-bus2 (JP1_IO2.63 JP2_IO2.63)
GPIO2_61: fpga1 (U1.H26), io-bus2 (JP1_IO2.64 JP2_IO2.64)
GPIO2_62: fpga1 (U1.E26), io-bus2 (JP1_IO2.65 JP2_IO2.65)
GPIO2_63: fpga1 (U1.H25), io-bus2 (JP1_IO2.66 JP2_IO2.66)
GPIO2_64: fpga1 (U1.F24), io-bus2 (JP1_IO2.67 JP2_IO2.67)
GPIO2_65: fpga1 (U1.G26), io-bus2 (JP1_IO2.68 JP2_IO2.68)
GPIO2_66: fpga1 (U1.E25), io-bus2 (JP1_IO2.69 JP2_IO2.69)
GPIO2_67: fpga1 (U1.F26), io-bus2 (JP1_IO2.70 JP2_IO2.70)
GPIO2_68: fpga1 (U1.F23), io-bus2 (JP1_IO2.71 JP2_IO2.71)
GPIO2_69: fpga1 (U1.G25), io-bus2 (JP1_IO2.72 JP2_IO2.72)
GPIO2_70: fpga2 (U1.E22), io-bus2 (JP1_IO2.73 JP2_IO2.73)
GPIO2_71: fpga2 (U1.F19), io-bus2 (JP1_IO2.74 JP2_IO2.74)
GPIO2_72: fpga2 (U1.E19), io-bus2 (JP1_IO2.75 JP2_IO2.75)
GPIO2_73: fpga2 (U1.F17), io-bus2 (JP1_IO2.76 JP2_IO2.76)
GPIO2_74: fpga2 (U1.E18), io-bus2 (JP1_IO2.77 JP2_IO2.77)
GPIO2_75: fpga2 (U1.C17), io-bus2 (JP1_IO2.78 JP2_IO2.78)
GPIO2_76: fpga2 (U1.E17), io-bus2 (JP1_IO2.79 JP2_IO2.79)
GPIO2_77: fpga2 (U1.E16), io-bus2 (JP1_IO2.80 JP2_IO2.80)
GPIO2_78: fpga2 (U1.D16), io-bus2 (JP1_IO2.81 JP2_IO2.81)
GPIO2_79: fpga2 (U1.C15), io-bus2 (JP1_IO2.82 JP2_IO2.82)
GPIO2_80: fpga1 (U1.K21), io-bus2 (JP1_IO2.83 JP2_IO2.83)
GPIO2_81: fpga2 (U1.D14), io-bus2 (JP1_IO2.84 JP2_IO2.84)
GPIO2_82: fpga1 (U1.K20), io-bus2 (JP1_IO2.85 JP2_IO2.85)
GPIO2_83: fpga1 (U1.F13), io-bus2 (JP1_IO2.86 JP2_IO2.86)
GPIO2_84: fpga2 (U1.B15), io-bus2 (JP1_IO2.87 JP2_IO2.87)
GPIO2_85: fpga2 (U1.C23), io-bus2 (JP1_IO2.88 JP2_IO2.88)
GPIO2_86: fpga1 (U1.J21), io-bus2 (JP1_IO2.89 JP2_IO2.89)
GPIO2_87: fpga2 (U1.A23), io-bus2 (JP1_IO2.90 JP2_IO2.90)
GPIO2_88: fpga1 (U1.J20), io-bus2 (JP1_IO2.91 JP2_IO2.91)
GPIO2_89: fpga2 (U1.B23), io-bus2 (JP1_IO2.92 JP2_IO2.92)
GPIO2_90: fpga1 (U1.H21), io-bus2 (JP1_IO2.93 JP2_IO2.93)
GPIO2_91: fpga2 (U1.A22), io-bus2 (JP1_IO2.94 JP2_IO2.94)
GPIO2_92: fpga2 (U1.C21), io-bus2 (JP1_IO2.95 JP2_IO2.95)
GPIO2_93: fpga2 (U1.B22), io-bus2 (JP1_IO2.96 JP2_IO2.96)
GPIO2_94: fpga2 (U1.C19), io-bus2 (JP1_IO2.97 JP2_IO2.97)
GPIO2_95: fpga2 (U1.D19), io-bus2 (JP1_IO2.98 JP2_IO2.98)
GPIO2_96: fpga2 (U1.A19), io-bus2 (JP1_IO2.99 JP2_IO2.99)
GPIO2_97: fpga2 (U1.B19), io-bus2 (JP1_IO2.100 JP2_IO2.100)
GPIO2_98: fpga2 (U1.B18), io-bus2 (JP1_IO2.101 JP2_IO2.101)
GPIO2_99: fpga2 (U1.C18), io-bus2 (JP1_IO2.102 JP2_IO2.102)
GPIO2_100: fpga2 (U1.A17), io-bus2 (JP1_IO2.103 JP2_IO2.103)
GPIO2_101: fpga2 (U1.D18), io-bus2 (JP1_IO2.104 JP2_IO2.104)
GPIO2_102: fpga2 (U1.A16), io-bus2 (JP1_IO2.105 JP2_IO2.105)
GPIO2_103: fpga2 (U1.B17), io-bus2 (JP1_IO2.106 JP2_IO2.106)
GPIO2_104: fpga2 (U1.A15), io-bus2 (JP1_IO2.107 JP2_IO2.107)
GPIO2_105: fpga2 (U1.B16), io-bus2 (JP1_IO2.108 JP2_IO2.108)
GPIO2_106: fpga2 (U1.D21), io-bus2 (JP1_IO2.109 JP2_IO2.109)
GPIO2_107: fpga2 (U1.A14), io-bus2 (JP1_IO2.110 JP2_IO2.110)
GPIO2_108: fpga2 (U1.D22), io-bus2 (JP1_IO2.111 JP2_IO2.111)
GPIO2_109: fpga2 (U1.C22), io-bus2 (JP1_IO2.112 JP2_IO2.112)
GPIO2_110: fpga1 (U1.C26), io-bus2 (JP1_IO2.113 JP2_IO2.113)
GPIO2_111: fpga1 (U1.C25), io-bus2 (JP1_IO2.114 JP2_IO2.114)
GPIO2_112: fpga1 (U1.G20), io-bus2 (JP1_IO2.115 JP2_IO2.115)
GPIO2_113: fpga1 (U1.D26), io-bus2 (JP1_IO2.116 JP2_IO2.116)
GPIO2_114: fpga1 (U1.G21), io-bus2 (JP1_IO2.117 JP2_IO2.117)
GPIO2_115: fpga1 (U1.H20), io-bus2 (JP1_IO2.118 JP2_IO2.118)
IFCLK: fpga2 (U1.AA7), usb (U1_USB.13)
INIT_B/WRX: fpga1 (R1_FP1.2 U1.AC14), usb (U1_USB.1 U1_USB.37)
LED0: fpga1 (U1.F9), switches (R1_SW.2)
LED1: fpga1 (U1.G9), switches (R2_SW.2)
LED2: fpga1 (U1.F10), switches (R3_SW.2)
LED3: fpga1 (U1.E10), switches (R4_SW.2)
LED4: fpga1 (U1.C12), switches (R5_SW.2)
LED5: fpga1 (U1.E13), switches (R6_SW.2)
LED6: fpga1 (U1.D13), switches (R7_SW.2)
LED7: fpga1 (U1.C13), switches (R8_SW.2)
LINESENSORCLK: fpga2 (U1.V20), io-bus (JP1_IO.82 JP2_IO.82)
LINESENSORIN1: fpga1 (U1.AA20), io-bus (JP1_IO.77 JP2_IO.77)
LINESENSORIN2: fpga1 (U1.Y18), io-bus (JP1_IO.79 JP2_IO.79)
LINESENSOROUT1: fpga1 (U1.AA18), io-bus (JP1_IO.78 JP2_IO.78)
LINESENSOROUT2: fpga2 (U1.W20), io-bus (JP1_IO.80 JP2_IO.80)
LOW BATTERY: fpga2 (U1.Y25), io-bus (JP1_IO.57 JP2_IO.57)
MDC: fpga2 (U1.AE12), ethernet (U1_ETH.31)
MDIO: fpga2 (U1.AF12), ethernet (R15_ETH.2 U1_ETH.30)
MISO: fpga2 (U1.AA11), spi-flash (U1_SPI.2), usb (U1_USB.35)
MOSI: fpga2 (U1.AA9), spi-flash (U1_SPI.5), usb (U1_USB.34)
POWER GOOD: fpga2 (U1.Y26), io-bus (JP1_IO.58 JP2_IO.58)
PROG_B: fpga-config (R4_CNF.1), usb (U1_USB.38)
PWM0: fpga2 (U1.AA21), io-bus (JP1_IO.61 JP2_IO.61)
PWM1: fpga2 (U1.AB24), io-bus (JP1_IO.63 JP2_IO.63)
PWM2: fpga2 (U1.AC26), io-bus (JP1_IO.65 JP2_IO.65)
PWM3: fpga2 (U1.W24), io-bus (JP1_IO.67 JP2_IO.67)
PWM4: fpga2 (U1.W25), io-bus (JP1_IO.69 JP2_IO.69)
PWM5: fpga2 (U1.W22), io-bus (JP1_IO.71 JP2_IO.71)
PWM6: fpga2 (U1.W21), io-bus (JP1_IO.73 JP2_IO.73)
PWM7: fpga2 (U1.V21), io-bus (JP1_IO.75 JP2_IO.75)
PWR_DOWN/INT: fpga2 (U1.AD12), ethernet (U1_ETH.7)
RDWR_B/WRU: fpga2 (U1.AC5), usb (U1_USB.30)
RESET: fpga1 (U1.AE19), io-bus (JP1_IO.3 JP2_IO.3), switches (R12_SW.2 S4_SW.2), usb (U1_USB.39)
RX_CLK: fpga2 (U1.AE7), ethernet (U1_ETH.38)
RX_DV: fpga2 (U1.AD5), ethernet (U1_ETH.39)
RX_ER: fpga2 (U1.AD4), ethernet (U1_ETH.41)
RXD_0: fpga2 (U1.AD6), ethernet (U1_ETH.43)
RXD_1: fpga2 (U1.AF8), ethernet (U1_ETH.44)
RXD_2: fpga2 (U1.AE4), ethernet (U1_ETH.45)
RXD_3: fpga2 (U1.AE8), ethernet (U1_ETH.46)
SCL: i2c (U1_I2C.6 U2_I2C.6), usb (R2_USB.1 U1_USB.15)
SCL_EXT: fpga2 (U1.U21), io-bus (JP1_IO.83 JP2_IO.83 R2_IO.1)
SCLK: fpga2 (U1.AA10), spi-flash (U1_SPI.6), usb (U1_USB.33)
SDA: i2c (S1_I2C.3 U1_I2C.7), usb (R3_USB.1 U1_USB.16)
SDA_EXT: fpga1 (U1.Y17), io-bus (JP1_IO.81 JP2_IO.81 R1_IO.1)
SERIAL IN: fpga2 (U1.AC7), jtag (JP2_JTAG.3)
SERIAL OUT: fpga2 (U1.AC6), jtag (JP2_JTAG.2)
SPI_CS_F: fpga2 (U1.Y8), spi-flash (U1_SPI.1), usb (U1_USB.36)
SWITCH0: fpga1 (U1.D7), switches (R13_SW.1 S5_SW.1)
SWITCH1: fpga1 (U1.F7), switches (R14_SW.1 S5_SW.2)
SWITCH2: fpga1 (U1.C6), switches (R15_SW.1 S5_SW.3)
SWITCH3: fpga1 (U1.D6), switches (R16_SW.1 S5_SW.4)
TCK: fpga-config (U1.B24), jtag (R1_JTAG.1)
TDI: fpga-config (U1.C1), jtag (R3_JTAG.1)
TDO: fpga-config (U1.D24), jtag (JP1_JTAG.3)
TMS: fpga-config (U1.A24), jtag (R2_JTAG.1)
TX_CLK: fpga2 (U1.AB9), ethernet (U1_ETH.1)
TX_EN: fpga2 (U1.AB10), ethernet (U1_ETH.2)
TXD_0: fpga2 (U1.AB11), ethernet (U1_ETH.3)
TXD_1: fpga2 (U1.AC10), ethernet (U1_ETH.4)
TXD_2: fpga2 (U1.AC11), ethernet (U1_ETH.5)
TXD_3: fpga2 (U1.AD10), ethernet (U1_ETH.6)
Vbus: io-bus (JP1_IO.31 JP1_IO.32 JP2_IO.31 JP2_IO.32), usb (U2_USB.5)
Vbus_sw: i2c (U1_I2C.5), usb (U2_USB.3)